# EAGLE design DCModuleSplitSupply (EAGLE 9.6.0)
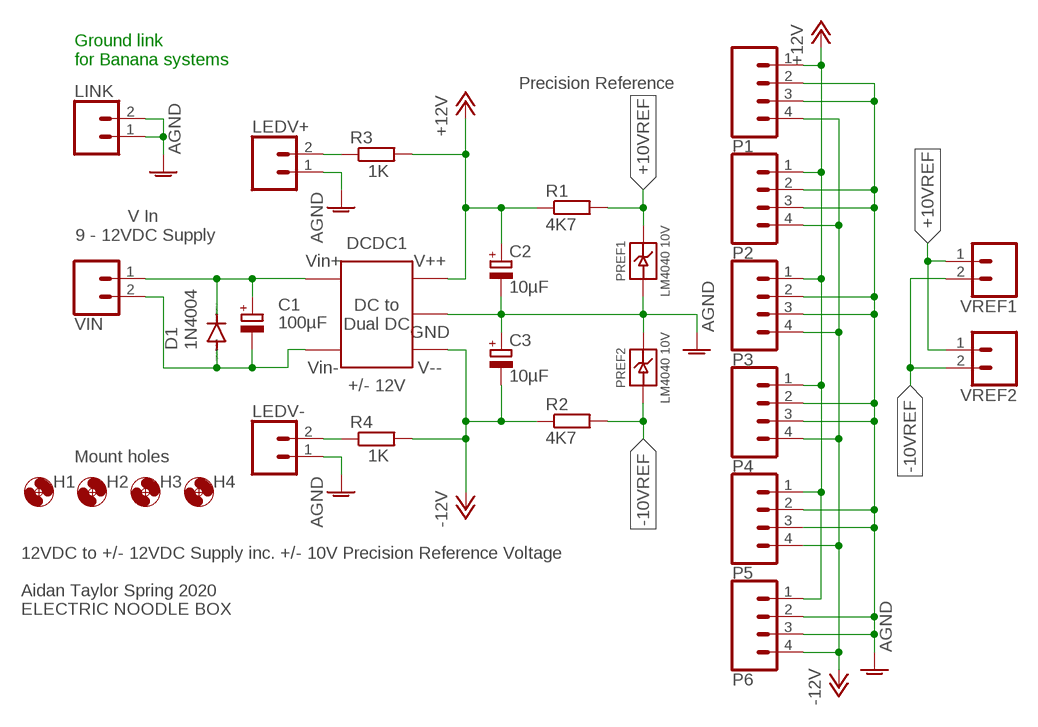
[diagram p0: schematic, sheet 1]

## Parts
C1  100µF  CPOL-EUE2.5-6  [E2,5-6]
C2  10µF  CPOL-EUE2-5  [E2-5]
C3  10µF  CPOL-EUE2-5  [E2-5]
D1  1N4004  [DO41-10]
DCDC1  +/- 12V  VRA1212ZP-6WR3  [VRA_ZP-6WR3_SERIES]
H1  MOUNT-HOLE3.2  [3,2]
H2  MOUNT-HOLE3.2  [3,2]
H3  MOUNT-HOLE3.2  [3,2]
H4  MOUNT-HOLE3.2  [3,2]
LEDV+  2XWIREPAD  [1X02]
LEDV-  2XWIREPAD  [1X02]
LINK  2XWIREPAD  [1X02]
P1  4XMOLEX  [MOLEX-1X4]
P2  4XMOLEX  [MOLEX-1X4]
P3  4XMOLEX  [MOLEX-1X4]
P4  4XMOLEX  [MOLEX-1X4]
P5  4XMOLEX  [MOLEX-1X4]
P6  4XMOLEX  [MOLEX-1X4]
PREF1  LM4040 10V  LM4040TH  [TO-92]
PREF2  LM4040 10V  LM4040TH  [TO-92]
R1  4K7  R-EU_0207/10  [0207/10]
R2  4K7  R-EU_0207/10  [0207/10]
R3  1K  R-EU_0207/10  [0207/10]
R4  1K  R-EU_0207/10  [0207/10]
VIN  2XMOLEX  [MOLEX-1X2]
VREF1  2XMOLEX  [MOLEX-1X2]
VREF2  2XMOLEX  [MOLEX-1X2]

## Nets
+10VREF: PREF1.2(CATHODE) R1.2 VREF1.1 VREF2.1
+12V: C2.+ DCDC1.VOUT+ P1.1 P2.1 P3.1 P4.1 P5.1 P6.1 R1.1 R3.2
-10VREF: PREF2.3(ANODE) R2.2 VREF1.2 VREF2.2
-12V: C3.- DCDC1.VOUT- P1.4 P2.4 P3.4 P4.4 P5.4 P6.4 R2.1 R4.2
AGND: C2.- C3.+ DCDC1.0V DCDC1.0V2(0V) LEDV+.1 LEDV-.1 LINK.1 LINK.2 P1.2 P1.3 P2.2 P2.3 P3.2 P3.3 P4.2 P4.3 P5.2 P5.3 P6.2 P6.3 PREF1.3(ANODE) PREF2.2(CATHODE)
N$2: LEDV+.2 R3.1
N$3: LEDV-.2 R4.1
N$4: C1.+ D1.C DCDC1.VIN2(VIN+) DCDC1.VIN(VIN+) VIN.1
N$5: C1.- D1.A DCDC1.GND2(VIN-) DCDC1.GND(VIN-) VIN.2

## Notes on the sheet
- Ground link
  for Banana systems
- Precision Reference
- V In 
  9 - 12VDC Supply
- Mount holes
- 12VDC to +/- 12VDC Supply inc. +/- 10V Precision Reference Voltage
  
  Aidan Taylor Spring 2020
  ELECTRIC NOODLE BOX

## Library data of the parts
C1-C3 = rcl:CPOL-EU: POLARIZED CAPACITOR, European symbol; SPICEPREFIX: C
D1 = diode:1N4004: DIODE general purpose rectifier, 1 A
DCDC1 = ElectricNoodleBox:VRA1212ZP-6WR3
H1-H4 = holes:MOUNT-HOLE: MOUNTING HOLE with drill center marker
LEDV+ LEDV- LINK = ElectricNoodleBox:2XWIREPAD
P1-P6 = ElectricNoodleBox:4XMOLEX
PREF1 PREF2 = ElectricNoodleBox:LM4040
R1-R4 = rcl:R-EU_: RESISTOR, European symbol; SPICEPREFIX: R
VIN VREF1 VREF2 = ElectricNoodleBox:2XMOLEX

## Board
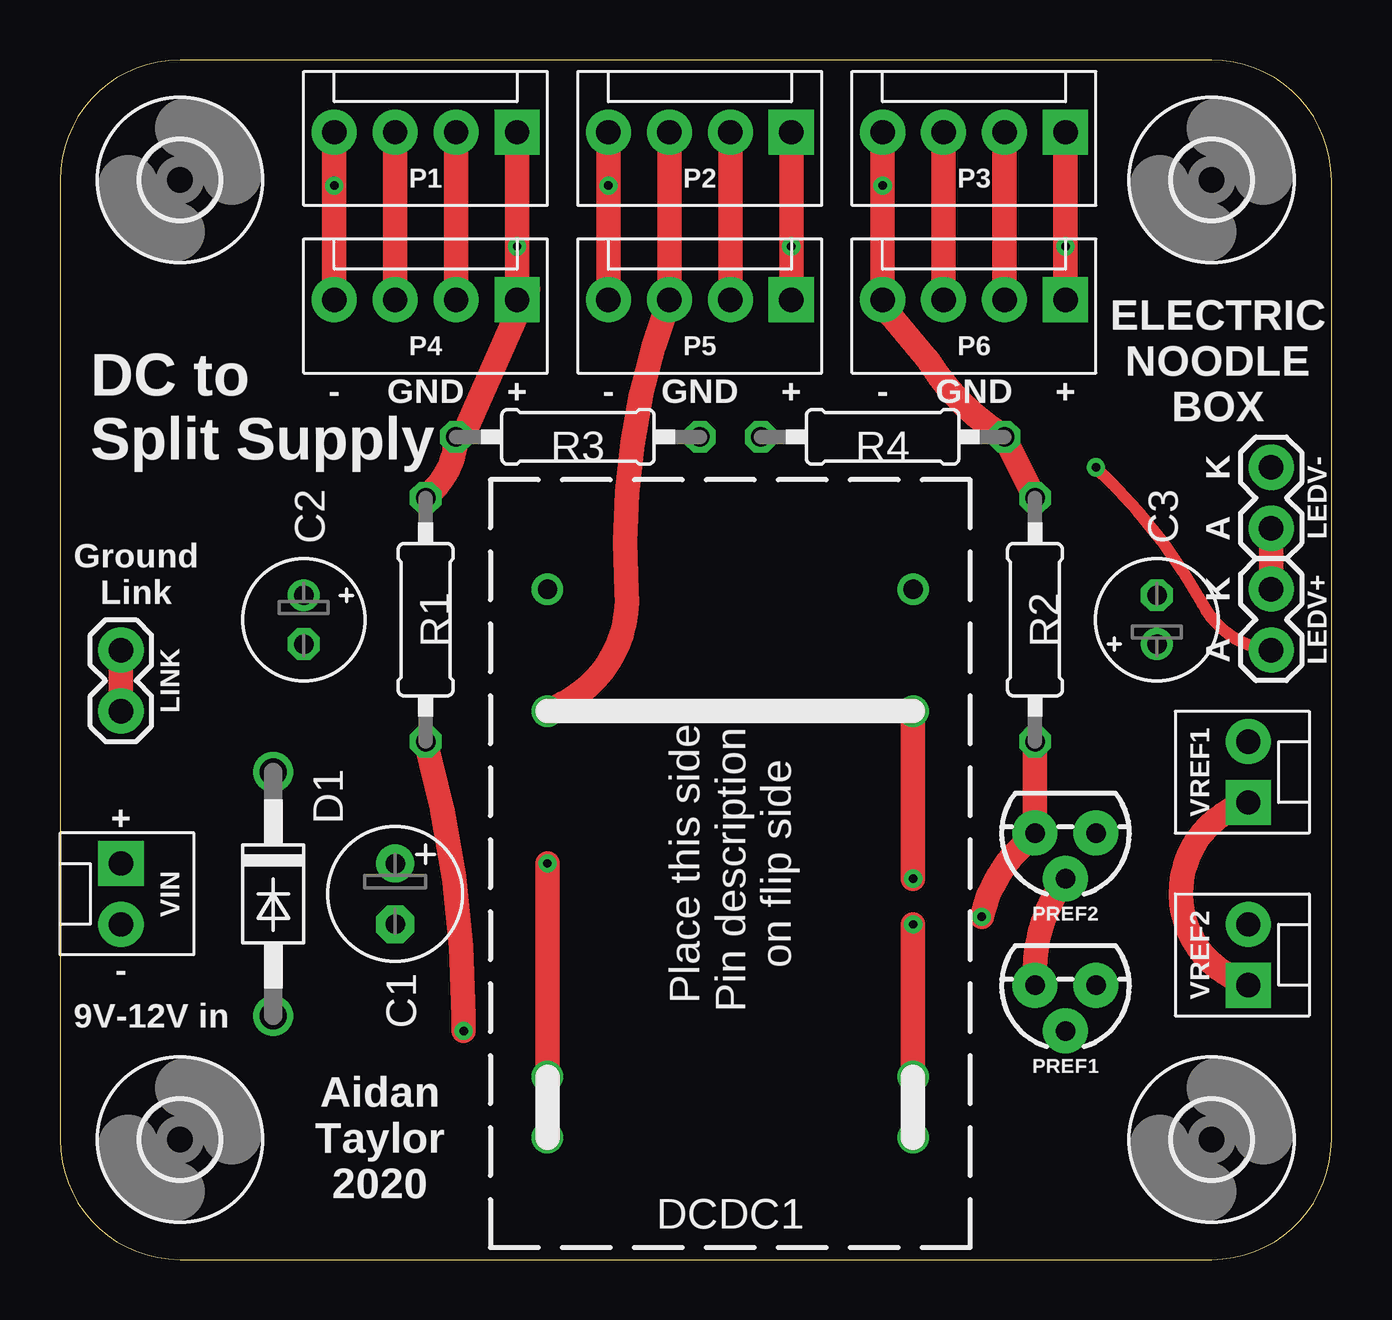
[diagram p1: board, top side]
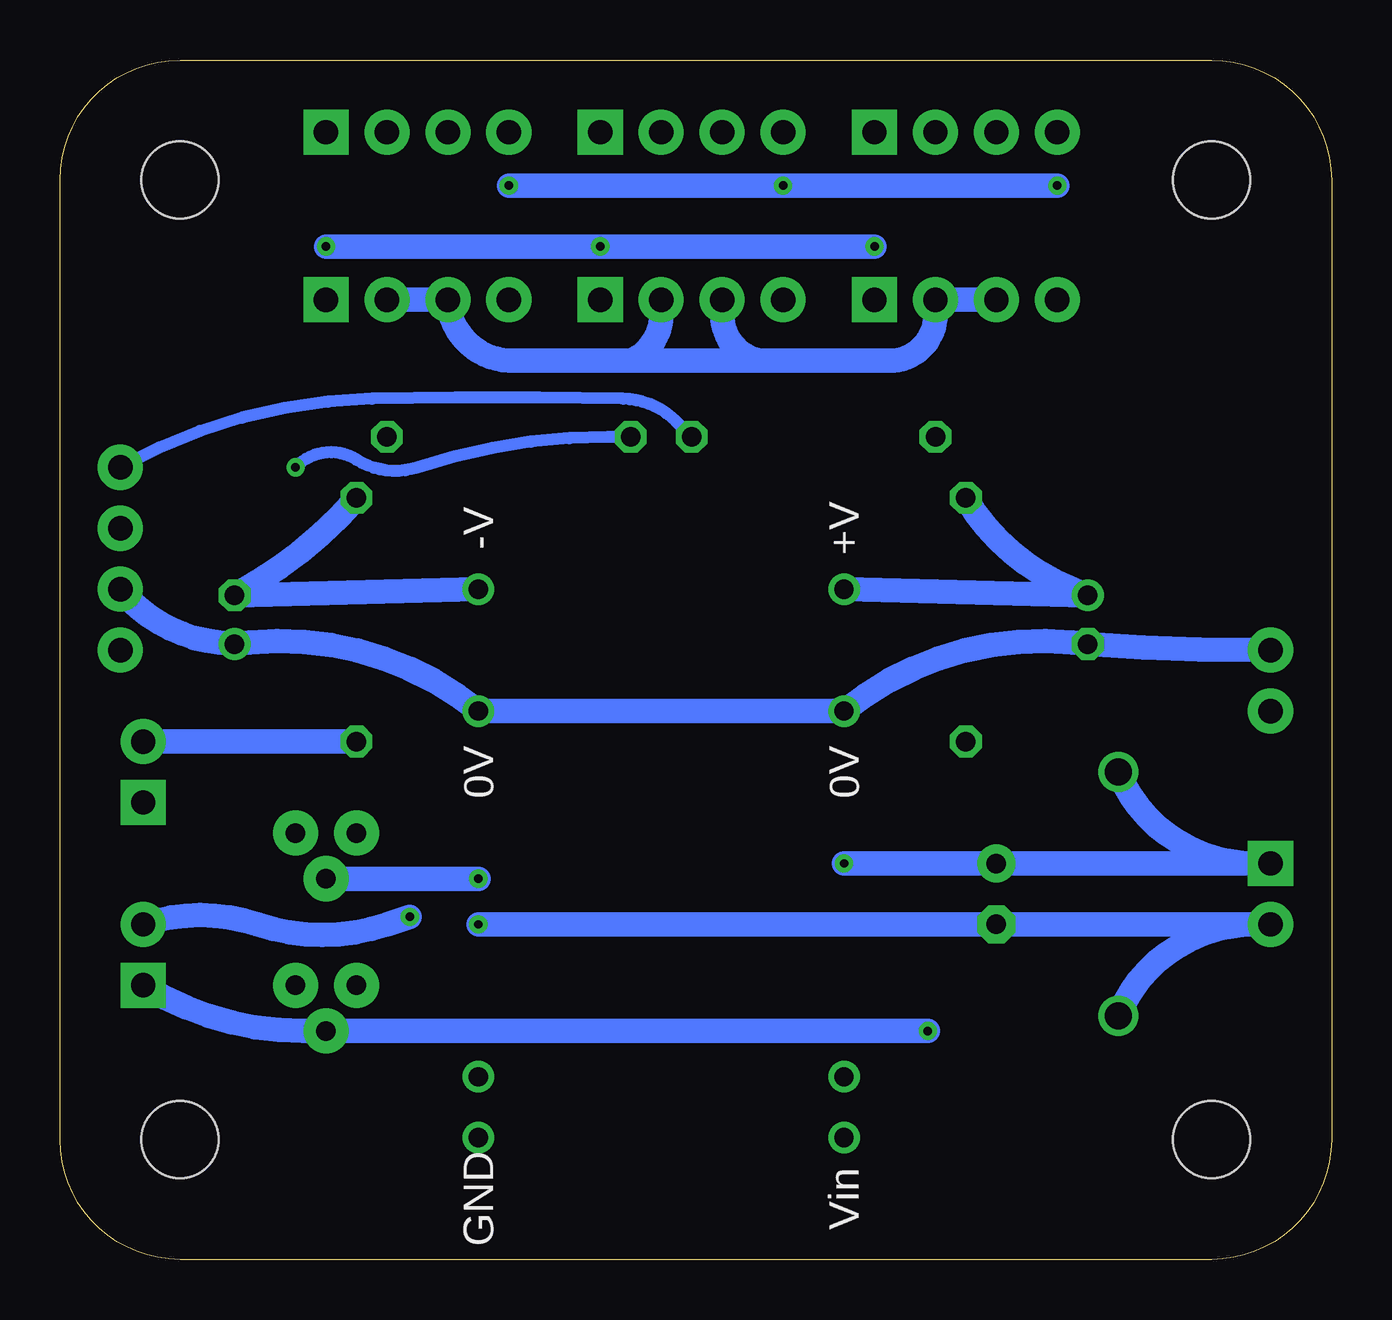
[diagram p2: board, bottom side, seen from below]

Size 53 x 50 mm. Coordinates in mm from the lower left corner, seen from the top.
Outline: 0,45 0,5 arc90 5,0 48,0 arc90 53,5 53,45 arc90 48,50 5,50 arc90 0,45
Copper layers (1*16): Top 0.035mm / dielectric 1.5mm / Bottom 0.035mm
Design rules "default": minimum track width 6mil, minimum drill 0.35mm, track to track 6mil, track to pad 6mil, pad to pad 6mil, via to via 6mil, smd to smd 6mil, copper to edge 40mil, drill to drill 6mil, minimum pad ring 10mil, minimum via ring 8mil, stop-mask expansion 4mil, vias tented up to drill 0mil, thermal gap 10mil

### Footprints (pad centres in the part's own frame; a part is rotated, then mirrored left to right if it is on the bottom)
E2,5-6 = drill 0.813 pad 1.6: + -1.27,0 | drill 0.813 pad 1.6 octagon: - 1.27,0
E2-5 = drill 0.813 pad 1.27: + -1.016,0 | drill 0.813 pad 1.27 octagon: - 1.016,0
DO41-10 = drill 1.118: A 5.08,0; C -5.08,0
VRA_ZP-6WR3_SERIES = drill 0.8: 0V 6.35,-7.62; 0V2 6.35,7.62; GND -11.43,-7.62; GND2 -8.89,-7.62; VIN -11.43,7.62; VIN2 -8.89,7.62; VOUT+ 11.43,7.62; VOUT- 11.43,-7.62
3,2 = hole 3.2: 0,0
1X02 = drill 1.016 pad 1.88: 1 0,0; 2 2.54,0
MOLEX-1X4 = drill 1.016 pad 1.88 square: 1 0,0 | drill 1.016 pad 1.88: 2 2.54,0; 3 5.08,0; 4 7.62,0
TO-92 = drill 0.813 pad 1.88: 1 -1.27,0; 2 0,1.905; 3 1.27,0
0207/10 = drill 0.813 octagon: 1 -5.08,0; 2 5.08,0
MOLEX-1X2 = drill 1.016 pad 1.88 square: 1 0,0 | drill 1.016 pad 1.88: 2 2.54,0

### Placement (x,y rotation side)
C1  13.97,15.24 270 top
C2  10.16,26.67 270 top
C3  45.72,26.67 90 top
D1  8.89,15.24 270 top
DCDC1  27.94,16.51 90 top
H1  5,5 0 top
H2  48,5 0 top
H3  48,45 0 top
H4  5,45 0 top
LEDV+  50.48,30.48 90 top
LEDV-  50.48,27.94 270 top
LINK  2.54,22.86 90 top
P1  19.05,46.99 180 top
P2  30.48,46.99 180 top
P3  41.91,46.99 180 top
P4  19.05,40.01 180 top
P5  30.48,40.01 180 top
P6  41.91,40.01 180 top
PREF1  41.91,11.43 180 top
PREF2  41.91,17.78 180 top
R1  15.24,26.67 270 top
R2  40.64,26.67 270 top
R3  21.59,34.29 180 top
R4  34.29,34.29 0 top
VIN  2.54,16.51 270 top
VREF1  49.53,19.05 90 top
VREF2  49.53,11.43 90 top

### Tracks (layer width: path | path; a pad name or v marks a point on that pad's centre or on a via)
+10VREF  (via drill 0.35)
  Top 1.016: v16.83,9.53 16.83,10.16 arc16 R1.2 | VREF2.1 48.9,11.75 arc-137 VREF1.1
  Bottom 1.016: VREF2.1 arc-32 42.86,9.53 PREF1.2 v16.83,9.53
+12V  (via drill 0.35)
  Top 1.016: R1.1 15.56,32.07 arc44 R3.2 arc48 17.02,34.8 19.51,40.44 P4.1 v19.05,42.23 P1.1 | P2.1 v30.48,42.23 P5.1 | P3.1 v41.91,42.23 P6.1
  Bottom 1.016: R1.1 arc-38 10.79,27.94 C2.+ DCDC1.VOUT+ | v19.05,42.23 v30.48,42.23 v41.91,42.23
-10VREF  (via drill 0.35)
  Top 1.016: R2.2 PREF2.3 40.01,17.14 arc32 v38.42,14.29
  Bottom 1.016: R2.2 VREF1.2 | v38.42,14.29 39.37,13.97 arc37 44.77,13.97 arc-37 VREF2.2
-12V  (via drill 0.35)
  Top 1.016: R2.1 R4.2 arc-26 36.2,37.47 34.61,39.37 P6.4 v34.29,44.77 P3.4 | P4.4 v11.43,44.77 P1.4 | P5.4 v22.86,44.77 P2.4
  Bottom 1.016: DCDC1.VOUT- C3.- 44.77,28.26 arc-19 R2.1 | v11.43,44.77 v22.86,44.77 23.81,44.77 v34.29,44.77
AGND  (via drill 0.35)
  Top 1.016: PREF1.3 40.64,12.06 arc-37 PREF2.2 | DCDC1.0V v35.56,15.88 | LINK.2 LINK.1 | P4.2 P1.2 | P4.3 P1.3 | P2.3 P5.3 arc25 23.62,27.84 arc-67 20.95,23.18 DCDC1.0V2 | P5.2 P2.2 | P3.3 P6.3 | P3.2 P6.2 | LEDV+.1 LEDV-.1
  Bottom 1.016: v35.56,15.88 PREF2.2 | LINK.2 3.17,25.4 arc4 C2.- 10.79,25.72 arc-45 DCDC1.0V2 DCDC1.0V arc-45 45.09,25.72 C3.+ 46.35,25.72 arc45 LEDV-.1 | P4.3 P4.2 16.51,39.37 arc90 18.41,37.47 23.81,37.47 | 23.81,37.47 29.21,37.47 | 29.21,37.47 34.29,37.47 arc83 P6.3 P6.2 | P5.3 25.4,39.37 arc-80 23.81,37.47 | P5.2 27.94,39.37 arc67 29.21,37.47
N$2
  Bottom 0.508: R3.1 27.3,34.92 arc-44 29.53,35.88 arc-3 40.01,35.88 arc-28 LEDV+.2
N$3  (via drill 0.35)
  Top 0.508: v43.18,33.02 43.81,32.38 arc-16 47.62,27.3 arc55 LEDV-.2
  Bottom 0.508: R4.1 30.16,34.29 arc-18 38.1,33.02 arc51 40.64,33.34 arc-79 v43.18,33.02
N$4  (via drill 0.35)
  Top 1.016: v20.32,16.51 DCDC1.VIN2 DCDC1.VIN
  Bottom 1.016: VIN.1 3.17,16.51 | 3.17,16.51 arc67 D1.C | 3.17,16.51 C1.+ v20.32,16.51
N$5  (via drill 0.35)
  Top 1.016: v35.56,13.97 DCDC1.GND2 DCDC1.GND
  Bottom 1.016: VIN.2 3.17,13.97 | D1.A arc67 3.17,13.97 | 3.17,13.97 C1.- v35.56,13.97

### Text on the board
tPlace: ELECTRIC / NOODLE / BOX | DC to / Split Supply | - | GND | + | - | GND | + | - | GND | + | K | A | Ground / Link | K | A | + | - | 9V-12V in | Aidan / Taylor / 2020